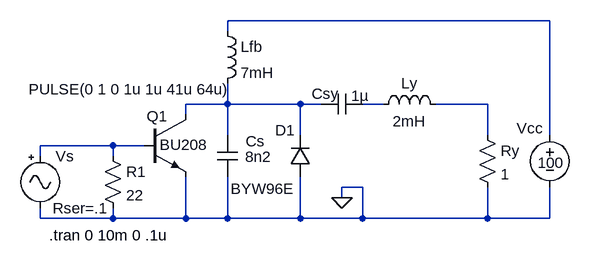
[diagram p0: schematic SalHorSimple.asc]
SalHorSimple.asc, the LTspice schematic file:
Version 4
SHEET 1 880 680
WIRE 592 80 96 80
WIRE 96 96 96 80
WIRE 96 208 96 176
WIRE 96 208 32 208
WIRE 208 208 96 208
WIRE 240 208 208 208
WIRE 336 208 304 208
WIRE 496 208 416 208
WIRE 32 224 32 208
WIRE 96 256 96 208
WIRE 208 256 208 208
WIRE 496 256 496 208
WIRE 592 256 592 80
WIRE -80 272 -192 272
WIRE -32 272 -80 272
WIRE -192 288 -192 272
WIRE -80 288 -80 272
WIRE 304 336 272 336
WIRE 272 352 272 336
WIRE -192 384 -192 368
WIRE -80 384 -80 368
WIRE -80 384 -192 384
WIRE 32 384 32 320
WIRE 32 384 -80 384
WIRE 96 384 96 320
WIRE 96 384 32 384
WIRE 208 384 208 320
WIRE 208 384 96 384
WIRE 304 384 304 336
WIRE 304 384 208 384
WIRE 496 384 496 336
WIRE 496 384 304 384
WIRE 592 384 592 336
WIRE 592 384 496 384
FLAG 272 352 0
SYMBOL ind 80 80 R0
SYMATTR InstName Lfb
SYMATTR Value 7mH
SYMATTR SpiceLine Rser=5
SYMBOL ind 320 224 R270
WINDOW 0 32 56 VTop 0
WINDOW 3 5 56 VBottom 0
SYMATTR InstName Ly
SYMATTR Value 2mH
SYMBOL cap 80 256 R0
WINDOW 0 44 9 Left 0
WINDOW 3 43 33 Left 0
SYMATTR InstName Cs
SYMATTR Value 8n2
SYMBOL cap 304 192 R90
WINDOW 0 16 58 VBottom 0
WINDOW 3 -12 4 VTop 0
SYMATTR InstName Csy
SYMATTR Value 1µ
SYMBOL res 480 240 R0
SYMATTR InstName Ry
SYMATTR Value 1
SYMBOL diode 224 320 R180
WINDOW 0 24 72 Left 0
WINDOW 3 26 -18 Left 0
SYMATTR InstName D1
SYMATTR Value BYW96E
SYMBOL npn3 -32 224 R0
WINDOW 0 4 3 Left 0
WINDOW 3 24 47 Left 0
SYMATTR InstName Q1
SYMATTR Value BU208
SYMBOL voltage 592 240 R0
WINDOW 0 -51 5 Left 0
WINDOW 3 -19 58 Left 0
SYMATTR InstName Vcc
SYMATTR Value 100
SYMBOL res -96 272 R0
SYMATTR InstName R1
SYMATTR Value 22
SYMBOL Misc\\signal -192 272 R0
WINDOW 3 -18 -87 Left 0
WINDOW 123 0 0 Left 0
WINDOW 39 19 96 Left 0
SYMATTR InstName Vs
SYMATTR Value PULSE(0 1 0 1u 1u 41u 64u)
SYMATTR SpiceLine Rser=.1
TEXT -178 410 Left 0 !.tran 0 10m 0 .1u

The netlist it stands for:
* SalHorSimple.asc
Lfb N001 N002 7mH Rser=5
Ly N003 N004 2mH
Cs N002 0 8n2
Csy N003 N002 1µ
Ry N004 0 1
D1 0 N002 BYW96E
Q1 N002 N005 0 0 BU208
Vcc N001 0 100
R1 N005 0 22
Vs N005 0 PULSE(0 1 0 1u 1u 41u 64u) Rser=.1
.model D D
.lib standard.dio
.model NPN NPN
.model PNP PNP
.lib standard.bjt
.tran 0 10m 0 .1u
.backanno
.end